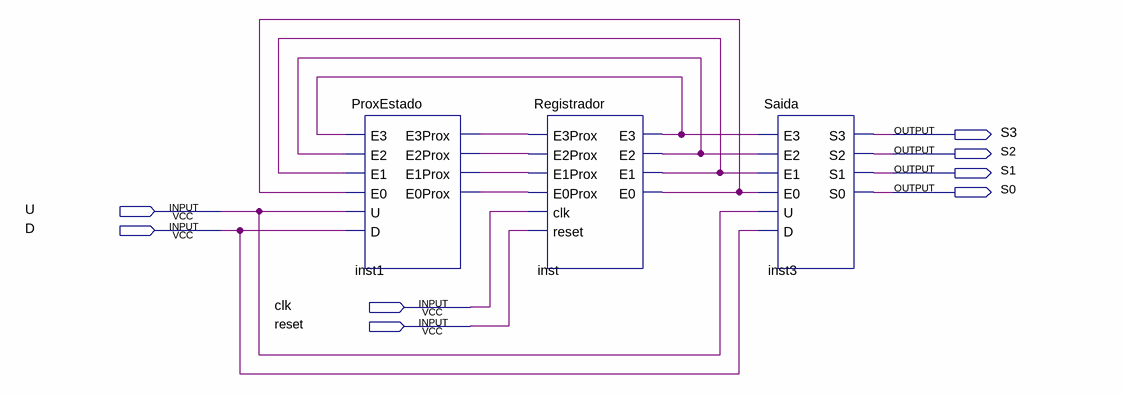
[diagram p0: schematic sheet]
// Quartus schematic Maquina.bdf as structural Verilog: 3 symbols, 8 pins
module Maquina (
  input  U,
  input  D,
  input  clk,
  input  reset,
  output S3,
  output S2,
  output S1,
  output S0
);

  wire inst1_e0prox, inst1_e1prox, inst1_e2prox, inst1_e3prox, inst_e0, inst_e1, inst_e2, inst_e3;

  ProxEstado inst1 (
    .E3(inst_e3), .E2(inst_e2), .E1(inst_e1), .E0(inst_e0), .U(U), .D(D), .E3Prox(inst1_e3prox),
    .E2Prox(inst1_e2prox), .E1Prox(inst1_e1prox), .E0Prox(inst1_e0prox));
  Registrador inst (
    .E3Prox(inst1_e3prox), .E2Prox(inst1_e2prox), .E1Prox(inst1_e1prox), .E0Prox(inst1_e0prox), .clk(clk),
    .reset(reset), .E3(inst_e3), .E2(inst_e2), .E1(inst_e1), .E0(inst_e0));
  Saida inst3 (
    .E3(inst_e3), .E2(inst_e2), .E1(inst_e1), .E0(inst_e0), .U(U), .D(D), .S3(S3), .S2(S2), .S1(S1), .S0(S0));
endmodule
